# Altium schematic sheet NRF24L01+.SchDoc
size A4
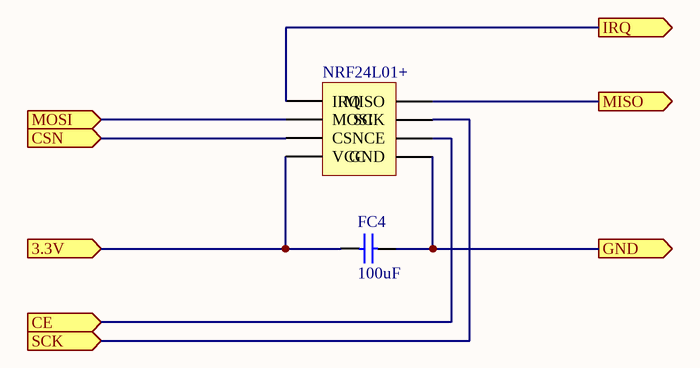
[diagram p0: NRF24L01+.SchDoc]

## Parts
FC4  100uF  [RAD-0.3]
NRF24L01+  nRF24L01+  [HDR2X4]  (value not drawn)

## Ports
3.3V (in), CE (in), CSN (in), GND (out), IRQ (out), MISO (out), MOSI (in), SCK (in)

## Nets
3.3V: FC4.1 NRF24L01+.2(VCC) ; port 3.3V
CE: NRF24L01+.3(CE) ; port CE
CSN: NRF24L01+.4(CSN) ; port CSN
GND: FC4.2 NRF24L01+.1(GND) ; port GND
IRQ: NRF24L01+.8(IRQ) ; port IRQ
MISO: NRF24L01+.7(MISO) ; port MISO
MOSI: NRF24L01+.6(MOSI) ; port MOSI
SCK: NRF24L01+.5(SCK) ; port SCK

## Library data of the parts
FC4 = Cap: Capacitor; Published: 8-Jun-2000; LatestRevisionDate: 17-Jul-2002; LatestRevisionNote: Re-released for DXP Platform.; PackageReference: RAD-0.3; Publisher: Altium Limited; PackageDescription: Radial Cap, Thru-Hole; 2 Leads; 0.3 in Pin Spacing; Value: 100uF
NRF24L01+ = Header 4X2: Header, 4-Pin, Dual row; LatestRevisionDate: 17-Jul-2002; LatestRevisionNote: Re-released for DXP Platform.; Publisher: Altium Limited